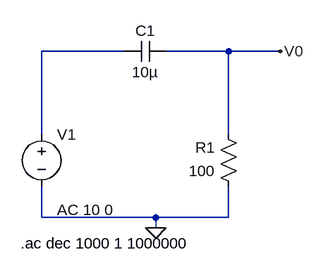
[diagram p0: schematic 1-krets-b.asc]
1-krets-b.asc, the LTspice schematic file:
Version 4
SHEET 1 880 680
WIRE 64 16 -64 16
WIRE 224 16 128 16
WIRE 304 16 224 16
WIRE -64 144 -64 16
WIRE 224 144 224 16
WIRE -64 272 -64 224
WIRE 112 272 -64 272
WIRE 224 272 224 224
WIRE 224 272 112 272
WIRE 112 288 112 272
FLAG 112 288 0
FLAG 304 16 V0
SYMBOL voltage -64 128 R0
WINDOW 3 24 160 Left 0
WINDOW 123 24 132 Left 0
WINDOW 39 0 0 Left 0
SYMATTR Value ""
SYMATTR Value2 AC 10 0
SYMATTR InstName V1
SYMBOL res 240 240 R180
WINDOW 0 36 76 Left 0
WINDOW 3 36 40 Left 0
SYMATTR InstName R1
SYMATTR Value 100
SYMBOL cap 128 0 R90
WINDOW 0 0 32 VBottom 0
WINDOW 3 32 32 VTop 0
SYMATTR InstName C1
SYMATTR Value 10µ
TEXT -96 312 Left 0 !.ac dec 1000 1 1000000

The netlist it stands for:
* 1-krets-b.asc
V1 N001 0 AC 10 0
R1 0 V0 100
C1 V0 N001 10µ
.ac dec 1000 1 1000000
.backanno
.end